# EAGLE design FuE_Schaltplan18 (EAGLE 7.7.0)
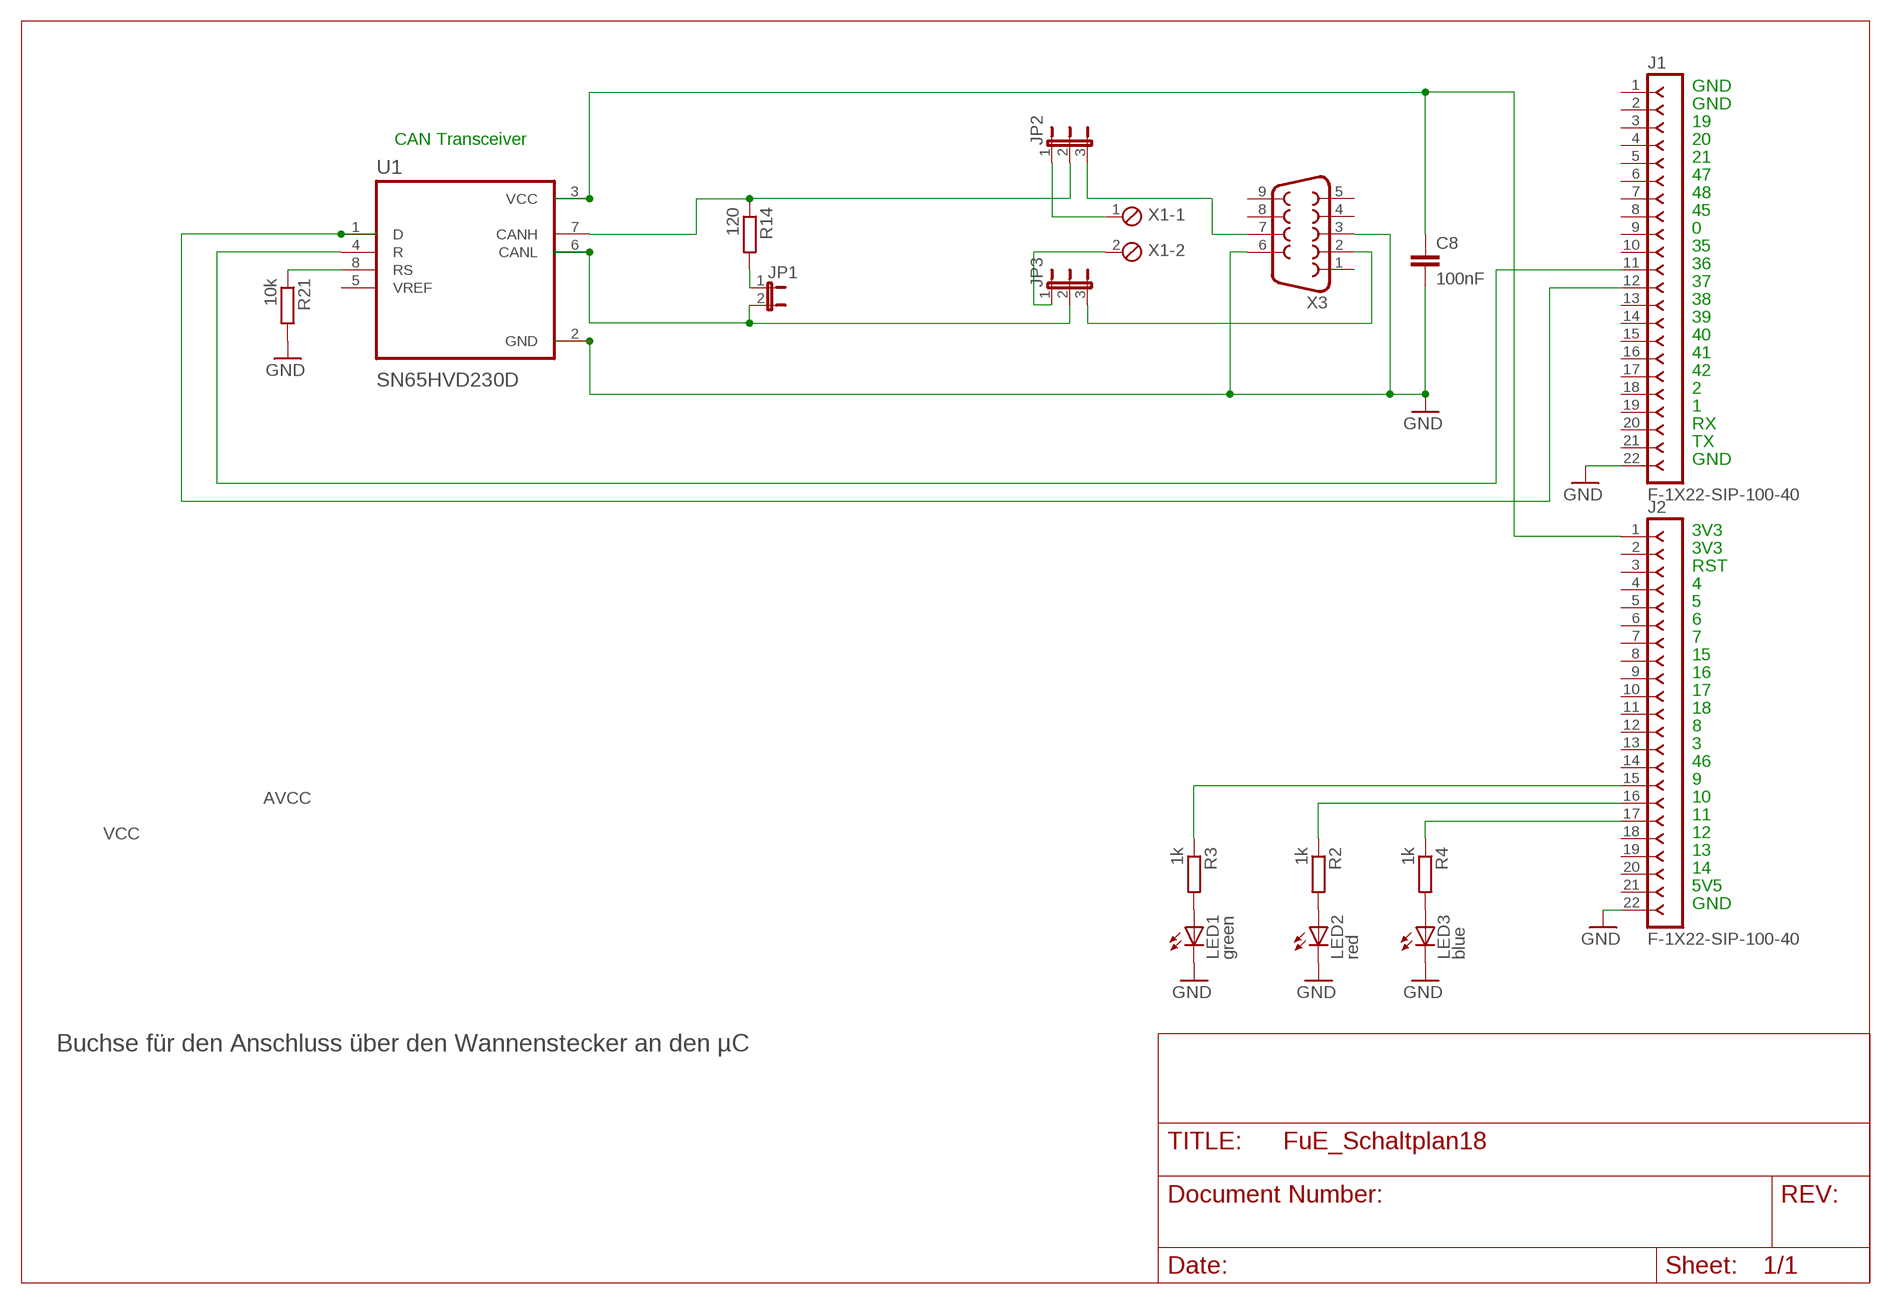
[diagram p0: schematic, sheet 1]

## Parts
C8  100nF  C-EUC0805  [C0805]
J1  F-1X22-SIP-100-40  [SIP-100-22-40]
J2  F-1X22-SIP-100-40  [SIP-100-22-40]
JP1  JP1E  [JP1]
JP2  JP2E  [JP2]
JP3  JP2E  [JP2]
LED1  green  LEDCHIP-LED0805  [CHIP-LED0805]
LED2  red  LEDCHIP-LED0805  [CHIP-LED0805]
LED3  blue  LEDCHIP-LED0805  [CHIP-LED0805]
R2  1k  R-EU_R0805  [R0805]
R3  1k  R-EU_R0805  [R0805]
R4  1k  R-EU_R0805  [R0805]
R14  120  R-EU_R0805  [R0805]
R21  10k  R-EU_R0805  [R0805]
U1  SN65HVD230D  [SOIC127P599X175-8N]
X1  MPT2  [2POL254]
X3  F09VP  [F09VP]

## Nets
GND: C8.2 J1.22 J2.22 LED1.C LED2.C LED3.C R21.2 U1.2(GND) X3.3 X3.6
N$1: C8.1 J2.1 U1.3(VCC)
N$2: J1.11 U1.4(R)
N$5: LED2.A R2.2
N$6: R21.1 U1.8(RS)
N$7: JP1.2 JP3.2 U1.6(CANL)
N$8: J2.16 R2.1
N$9: LED1.A R3.2
N$10: LED3.A R4.2
N$11: J2.15 R3.1
N$12: J2.17 R4.1
N$13: JP2.3 X3.7
N$14: JP2.2 R14.1 U1.7(CANH)
N$15: J1.12 U1.1(D)
N$16: JP3.3 X3.2
N$17: JP1.1 R14.2
N$19: JP2.1 X1.1
N$20: JP3.1 X1.2
Unconnected: J1.1 J1.2 J1.3 J1.4 J1.5 J1.6 J1.7 J1.8 J1.9 J1.10 J1.13 J1.14 J1.15 J1.16 J1.17 J1.18 J1.19 J1.20 J1.21 J2.2 J2.3 J2.4 J2.5 J2.6 J2.7 J2.8 J2.9 J2.10 J2.11 J2.12 J2.13 J2.14 J2.18 J2.19 J2.20 J2.21 U1.5(VREF) X3.1 X3.4 X3.5 X3.8 X3.9

## Notes on the sheet
- GND
- GND
- 19
- CAN Transceiver | 20
- 21
- 47
- 48
- 45
- 0
- 35
- 36
- 37
- 38
- 39
- 40
- 41
- 42
- 2
- 1
- RX
- TX
- GND
- 3V3
- 3V3
- RST
- 4
- 5
- 6
- 7
- 15
- 16
- 17
- 18
- 8
- 3
- 46
- 9
- AVCC
- 10
- 11
- VCC
- 12
- 13
- 14
- 5V5
- GND
- Buchse für den Anschluss über den Wannenstecker an den µC

## Library data of the parts
C8 = rcl:C-EU: CAPACITOR, European symbol; SPICEPREFIX: C
J1 J2 = con-headers-jp:F-1X22-: FEMALE HEADER
JP1 = jumper:JP1E: JUMPER
JP2 JP3 = jumper:JP2E: JUMPER
LED1-LED3 = led:LED: LED OSRAM: - CHIPLED LG R971, LG N971, LY N971, LG Q971, LY Q971, LO R971, LY R971 LH N974, LH R974 LS Q976, LO Q976, LY Q976 LO Q996 - Hyper CHIPLED LW Q18S LB Q993, LB Q99A, LB R99A - SideLED LS A670, LO A670, LY A670, LG A670, LP A670 LB A673, LV A673, LT A673, LW A673 LH A674 LY A675 LS A676, LA A676, LO A676, LY A676, LW A676 LS A679, LY A679, LG A679 - Hyper Micro SIDELED® LS Y876, LA Y876, LO Y876, LY Y876 LT Y87S - SmartLED LW L88C, LW L88S LB L89C, LB L89S, LG L890 LS L89K, LO L89K, LY L89K LS L896, LA L896, LO L896, LY L896 - TOPLED LS T670, LO T670, LY T670, LG T670, LP T670 LSG T670, LSP T670, LSY T670, LOP T670, LYG T670 LG T671, LOG T671, LSG T671 LB T673, LV T673, LT T673, LW T673 LH T674 LS T676, LA T676, LO T676, LY T676, LB T676, LH T676, LSB T676, LW T676 LB T67C, LV T67C, LT T67C, LS T67K, LO T67K, LY T67K, LW E67C LS E67B, LA E67B, LO E67B, LY E67B, LB E67C, LV E67C, LT E67C LW T67C LS T679, LY T679, LG T679 LS T770, LO T770, LY T770, LG T770, LP T770 LB T773, LV T773, LT T773, LW T773 LH T774 LS E675, LA E675, LY E675, LS T675 LS T776, LA T776, LO T776, LY T776, LB T776 LHGB T686 LT T68C, LB T68C - Hyper Mini TOPLED® LB M676 - Mini TOPLED Santana® LG M470 LS M47K, LO M47K, LY M47K Source: http://www.osram.convergy.de LUXEON: - LUMILED® LXK2-PW12-R00, LXK2-PW12-S00, LXK2-PW14-U00, LXK2-PW14-V00 LXK2-PM12-R00, LXK2-PM12-S00, LXK2-PM14-U00 LXK2-PE12-Q00, LXK2-PE12-R00, LXK2-PE12-S00, LXK2-PE14-T00, LXK2-PE14-U00 LXK2-PB12-K00, LXK2-PB12-L00, LXK2-PB12-M00, LXK2-PB14-N00, LXK2-PB14-P00, LXK2-PB14-Q00 LXK2-PR12-L00, LXK2-PR12-M00, LXK2-PR14-Q00, LXK2-PR14-R00 LXK2-PD12-Q00, LXK2-PD12-R00, LXK2-PD12-S00 LXK2-PH12-R00, LXK2-PH12-S00 LXK2-PL12-P00, LXK2-PL12-Q00, LXK2-PL12-R00 Source: www.luxeon.com KINGBRIGHT: KA-3528ASYC Source: www.kingbright.com
R2-R4 R14 R21 = rcl:R-EU_: RESISTOR, European symbol
U1 = SN65HVD230D:SN65HVD230D: Check availability <https://pricing.snapeda.com/parts/SN65HVD230D/Texas%20Instruments/view-part?ref=eda>; AVAILABILITY: In Stock; CHECK_PRICES: https://www.snapeda.com/parts/SN65HVD230D/Texas+Instruments/view-part/?ref=eda; DESCRIPTION: 3.3 V CAN Transceiver with Standby Mode; MF: Texas Instruments; MP: SN65HVD230D; PACKAGE: SOIC-8 Texas Instruments; PRICE: None; PURCHASE-URL: https://www.snapeda.com/api/url_track_click_mouser/?unipart_id=51766&manufacturer=Texas Instruments&part_name=SN65HVD230D&search_term=sn65hvd230; SNAPEDA_LINK: https://www.snapeda.com/parts/SN65HVD230D/Texas+Instruments/view-part/?ref=snap
X1 = con-phoenix-254:MPT2: PHOENIX CONNECTOR; OC_FARNELL: unknown; OC_NEWARK: unknown
X3 = con-subd:F09: SUB-D; OC_FARNELL: unknown; OC_NEWARK: unknown

## Board
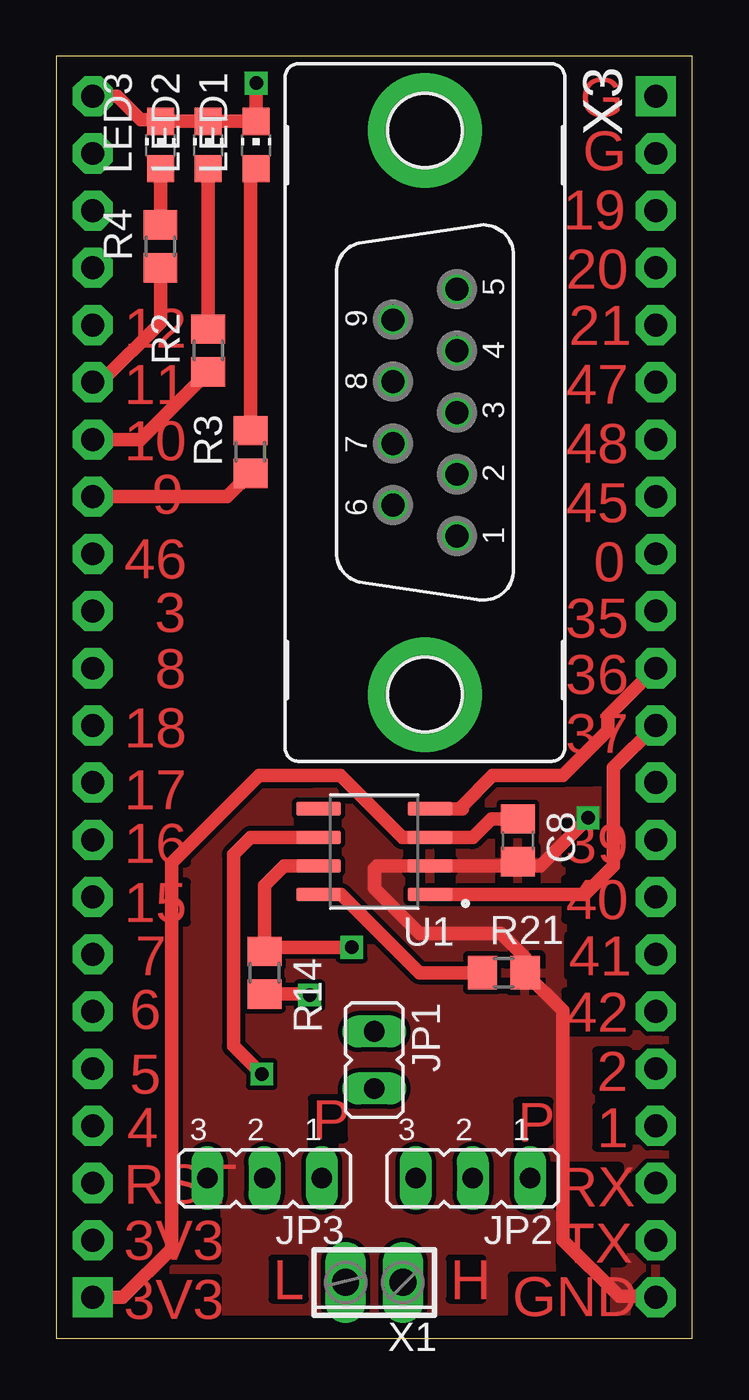
[diagram p1: board, top side]
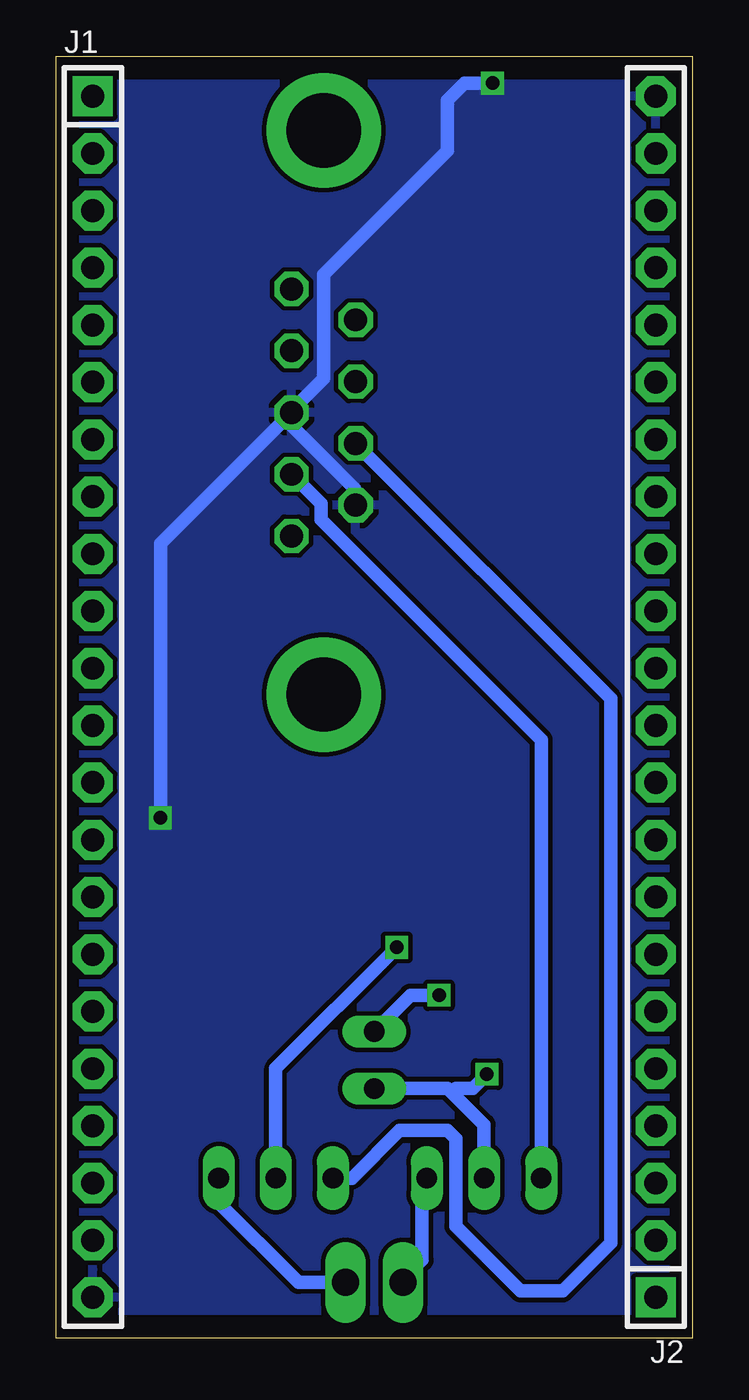
[diagram p2: board, bottom side, seen from below]

Size 28.25 x 56.93 mm. Coordinates in mm from the lower left corner, seen from the top.
Outline: 0,56.93 0,0 28.25,0 28.25,56.93 0,56.93
Copper layers (1*16): Top 0.035mm / dielectric 1.5mm / Bottom 0.035mm
Design rules "default *": minimum track width 6mil, minimum drill 0.35mm, track to track 8mil, track to pad 8mil, pad to pad 8mil, via to via 8mil, smd to smd 6mil, copper to edge 40mil, drill to drill 6mil, minimum pad ring 10mil, minimum via ring 8mil, stop-mask expansion 4mil, vias tented up to drill 0mil, thermal gap 10mil

### Footprints (pad centres in the part's own frame; a part is rotated, then mirrored left to right if it is on the bottom)
C0805 = smd 1.3 x 1.5: 1 -0.95,0; 2 0.95,0
SIP-100-22-40 = drill 1.016 pad 1.778 square: 1 -26.67,0 | drill 1.016 pad 1.778 octagon: 2 -24.13,0; 3 -21.59,0; 4 -19.05,0; 5 -16.51,0; 6 -13.97,0; 7 -11.43,0; 8 -8.89,0; 9 -6.35,0; 10 -3.81,0; 11 -1.27,0; 12 1.27,0; 13 3.81,0; 14 6.35,0; 15 8.89,0; 16 11.43,0; 17 13.97,0; 18 16.51,0; 19 19.05,0; 20 21.59,0; 21 24.13,0; 22 26.67,0
JP1 = drill 0.914 long: 1 0,-1.27; 2 0,1.27
JP2 = drill 0.914 long: 1 -2.54,0; 2 0,0; 3 2.54,0
CHIP-LED0805 = smd 1.2 x 1.2: A 0,-1.05; C 0,1.05
R0805 = smd 1.3 x 1.5: 1 -0.95,0; 2 0.95,0
SOIC127P599X175-8N = smd 1.97 x 0.6: 1 -2.47,1.905; 2 -2.47,0.635; 3 -2.47,-0.635; 4 -2.47,-1.905; 5 2.47,-1.905; 6 2.47,-0.635; 7 2.47,0.635; 8 2.47,1.905
2POL254 = drill 1.2 long: 1 -1.27,0; 2 1.27,0
F09VP = drill 1.016 octagon: 1 5.486,1.422; 2 2.743,1.422; 3 0,1.422; 4 -2.743,1.422; 5 -5.486,1.422; 6 4.115,-1.422; 7 1.372,-1.422; 8 -1.372,-1.422; 9 -4.115,-1.422 | drill 3.302 pad 5.08: G1 -12.522,0; G2 12.522,0

### Placement (x,y rotation side)
C8  20.5,22.11 270 top
J1  26.62,28.49 270 bottom
J2  1.62,28.49 90 bottom
JP1  14.12,12.36 180 top
JP2  18.5,7.11 180 top
JP3  9.25,7.11 180 top
LED1  8.88,52.99 0 top
LED2  6.75,52.99 0 top
LED3  4.62,52.99 0 top
R2  6.75,43.86 90 top
R3  8.62,39.36 90 top
R4  4.62,48.49 90 top
R14  9.25,16.24 270 top
R21  19.88,16.24 0 top
U1  14.12,21.61 180 top
X1  14.12,2.49 180 top
X3  16.38,41.11 270 top

### Tracks (layer width: path | path; a pad name or v marks a point on that pad's centre or on a via)
GND  (via drill 0.6)
  Top 0.61: U1.2 16.99,20.98 | U1.2 18.01,20.98 | U1.2 20.32,20.98 C8.2 | J1.22 26.62,1.86 25,1.86 22.5,4.36 22.5,14.56 R21.2 20.82,16.91 19.75,17.99 16.12,17.99 14.12,19.99 14.12,20.86 14.25,20.99 U1.2 | U1.2 | U1.2 21.5,20.99 v23.62,23.11 | J2.22 2.71,55.16 3.75,54.11 4.55,54.11 LED3.C LED2.C LED1.C v8.88,55.74
  Bottom 0.61: v8.88,55.74 10.12,55.74 10.88,54.99 10.88,52.74 16.38,47.24 16.38,42.61 17.8,41.19 X3.3 | X3.3 17.8,40.53 15,37.74 15,37.05 X3.6 15,36.95 | v23.62,23.11 23.62,35.28 X3.3
  pour Top: 7.25,24.24 28,24.36 28,0.24 0.25,0.24 0.38,24.24
  pour Bottom: 0.38,56.61 27.75,56.61 27.5,0.24 0.38,0.36
N$1
  Top 0.61: C8.1 19.32,23.06 18.5,22.24 16.61,22.24 U1.3 15.38,22.24 12.62,24.99 9,24.99 5.12,21.11 5.12,3.99 2.96,1.82 J2.1
N$2
  Top 0.61: U1.4 18.03,23.52 18.03,23.64 19.38,24.99 22.5,24.99 24.5,26.99 24.5,27.63 J1.11
N$5
  Top 0.61: R2.2 LED2.A
N$6
  Top 0.61: U1.8 12.65,19.71 16.12,16.24 R21.1
N$7  (via drill 0.6)
  Top 0.61: U1.6 8.63,22.25 7.88,21.49 7.88,12.99 v9.12,11.74
  Bottom 0.61: JP1.2 14.11,11.11 10.88,11.11 10.69,10.93 | JP3.2 9.25,9.49 10.69,10.93 | v9.12,11.74 9.75,11.11 10.5,11.11 10.69,10.93
N$8
  Top 0.61: J2.16 3.75,39.92 R2.1
N$9
  Top 0.61: R3.2 8.62,51.69 LED1.A
N$10
  Top 0.61: R4.2 LED3.A
N$11
  Top 0.61: J2.15 7.59,37.38 R3.1
N$12
  Top 0.61: J2.17 1.97,42.46 4.62,45.11 R4.1
N$13
  Bottom 0.61: JP2.3 15.12,7.11 13,9.24 10.88,9.24 10.5,8.86 10.5,4.99 7.62,2.11 5.75,2.11 3.62,4.24 3.62,28.41 X3.7
N$14  (via drill 0.6)
  Top 0.61: U1.7 10.12,20.99 9.25,20.11 R14.1 9.43,17.36 v13.12,17.36
  Bottom 0.61: JP2.2 18.5,11.99 v13.12,17.36
N$15
  Top 0.61: U1.1 23.47,19.71 24.75,20.99 24.75,25.34 J1.12
N$16
  Bottom 0.61: JP3.3 6.71,26.57 16.5,36.36 16.5,37.07 X3.2
N$17  (via drill 0.6)
  Top 0.61: R14.2 11.2,15.29 v11.25,15.24
  Bottom 0.61: v11.25,15.24 12.52,15.24 JP1.1
N$19
  Bottom 0.61: X1.1 17.5,2.49 21.12,6.11 21.12,7.03 JP2.1
N$20
  Bottom 0.61: X1.2 12.86,2.63 12,3.49 12,6.9 JP3.1

### Text on the board
Top: G | G | 19 | 20 | 12 | 21 | 11 | 47 | 10 | 48 | 9 | 45 | 46 | 0 | 3 | 35 | 8 | 36 | 18 | 37 | 17 | 16 | 39 | 40 | 15 | 7 | 41 | 6 | 42 | 5 | 2 | P | P | 4 | 1 | RST | RX | 3V3 | TX | L | H | 3V3 | GND